# Altium schematic sheet OMD_105V_5V_Buck.SchDoc
size A3; Organization: Altium Limited; Address1: L3, 12a Rodborough Rd; Address2: Frenchs Forest; Address3: NSW; Address4: Australia 2086
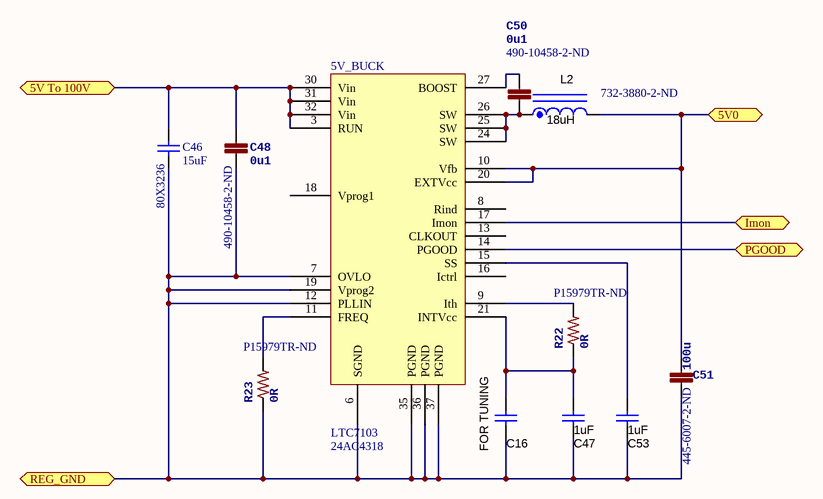
[diagram p0: OMD_105V_5V_Buck.SchDoc]

## Parts
5V_BUCK  LTC7103  Supplier Part Number 1: 24AC4318  [LTC7103]
C16  FOR TUNING  [0201-cap]  (no BOM)
C46  value 15uF  Supplier Part Number 1: 80X3236  [CAPC5750L]  (hidden comment: Cap)
C47  value 1uF  [0603-CAP]
C48  0u1  Supplier Part Number 1: 490-10458-2-ND  [0402-CAP]
C50  0u1  Supplier Part Number 1: 490-10458-2-ND  [0402-CAP]
C51  100u  Supplier Part Number 1: 445-6007-2-ND  [1206-CAP]
C53  value 1uF  [0603-CAP]
L2  value 18uH  [WE_IND]  (hidden comment: 732-3880-2-ND)
R22  0R  Supplier Part Number 1: P15979TR-ND  [0201-RES]
R23  0R  Supplier Part Number 1: P15979TR-ND  [0201-RES]

## Ports
5V0, 5V To 100V, Imon, PGOOD, REG_GND

## Nets
5V0: 5V_BUCK.10(Vfb) 5V_BUCK.20(EXTVcc) C51.1 L2.2 ; port 5V0
5V To 100V: 5V_BUCK.3(RUN) 5V_BUCK.30(Vin) 5V_BUCK.31(Vin) 5V_BUCK.32(Vin) C46.2 C48.P$1 ; port 5V To 100V
Imon: 5V_BUCK.17(Imon) ; port Imon
PGOOD: 5V_BUCK.14(PGOOD) ; port PGOOD
REG_GND: 5V_BUCK.6(SGND) 5V_BUCK.7(OVLO) 5V_BUCK.12(PLLIN) 5V_BUCK.19(Vprog2) 5V_BUCK.35(PGND) 5V_BUCK.36(PGND) 5V_BUCK.37(PGND) C16.1 C46.1 C47.1 C48.P$2 C51.2 C53.1 R23.1 ; port REG_GND
Net5V_BUCK_9: 5V_BUCK.9(Ith) R22.2
Net5V_BUCK_11: 5V_BUCK.11(FREQ) R23.2
Net5V_BUCK_15: 5V_BUCK.15(SS) C53.2
Net5V_BUCK_21: 5V_BUCK.21(INTVcc) C16.2 C47.2 R22.1
Net5V_BUCK_24: 5V_BUCK.24(SW) 5V_BUCK.25(SW) 5V_BUCK.26(SW) C50.P$2 L2.1
Net5V_BUCK_27: 5V_BUCK.27(BOOST) C50.P$1

Not connected (* = marked no-connect by the designer): 5V_BUCK 8(Rind) 13(CLKOUT) 16(Ictrl) 18(Vprog1)

## Notes on the sheet
- https://github.com/OpenMotorDrive
- https://creativecommons.org/licenses/by-nc-sa/4.0/
- Title
- Size:
- Date:
- A3
- Number:
- Time:
- Revision:
- Sheet
- of
- ProfiCNC Pty. Ltd.
- For Commercial use, please contact ProfiCNC
- ProfiCNC does NOT guaranty these drawings as fit for any purpose, you must verify this information before attempting to use it in any way.  USE AT OWN RISK
- File:

## Library data of the parts
C16 = GRM188R70J105KA01D
C46 = Cap: Capacitor; Supplier 1: Newark
C47 C53 = GRM188R70J105KA01D: CAP, CERM, 1 µF, 6.3 V, +/- 10%, X7R, 0603; Supplier 1: Digi-Key; Supplier Part Number 1: 490-3898-1-ND
C48 C50 = CAP0402: CAP CER 0.1UF 16V Y5V 0402; Value: 0u1; Supplier 1: Digi-Key
C51 = CAPACITOR-1206: PARTNO: C3216X5R1A107M160AC; DOC_NUM: 1; YEAR: 2014; REV: X2; Supplier 1: Digi-Key
L2 = SD53-150-R: Description FIXED IND 18UH 7.5A 22 MOHM SMD; Supplier 1: Digi-Key; Supplier Part Number 1: 732-3880-2-ND
R22 R23 = RESISTOR0402-RES: RES 0OHM 1/16W 1% 0201 SMD; Supplier 1: Digi-Key
5V_BUCK = LTC7103: Supplier 1: Newark